# EAGLE design Protector (EAGLE 5.07)
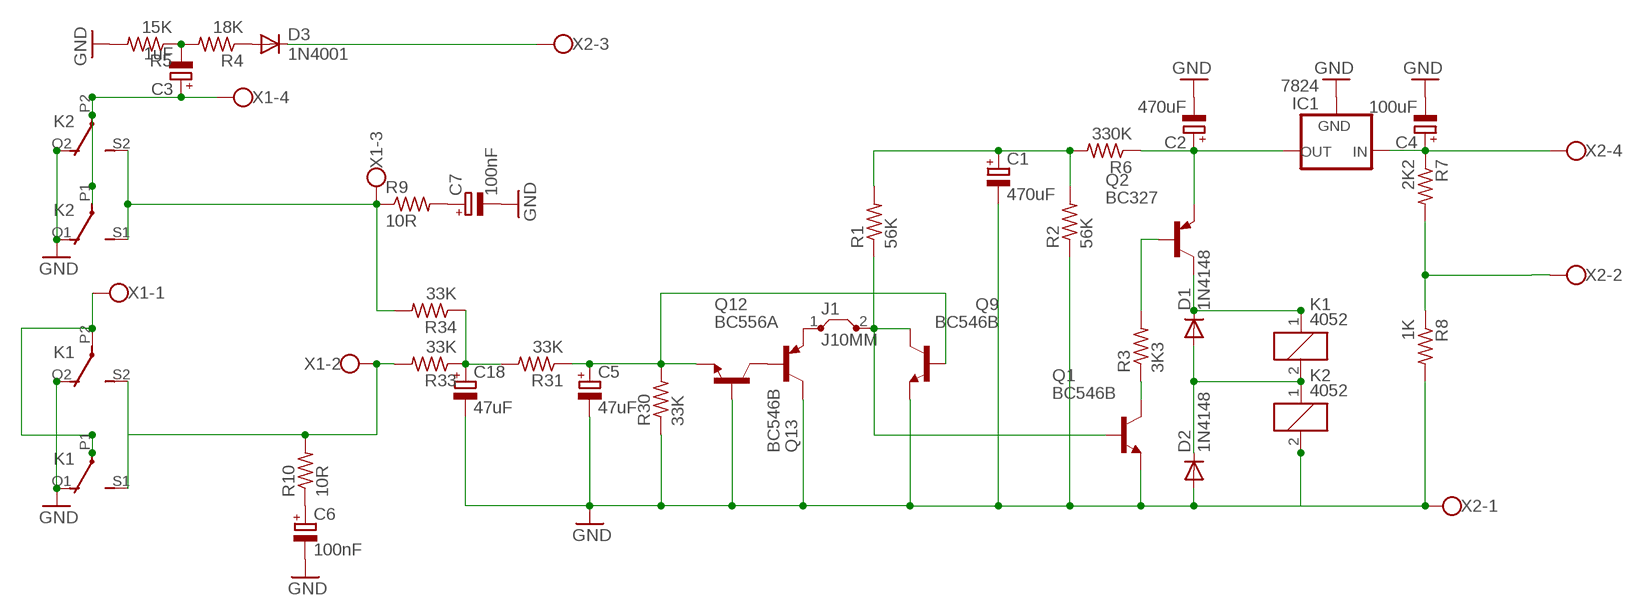
[diagram p0: schematic, sheet 1]

## Parts
C1  470uF  CPOL-EUE5-8.5  [E5-8,5]
C2  470uF  CPOL-EUE5-8.5  [E5-8,5]
C3  1uF  CPOL-EUE5-8.5  [E5-8,5]
C4  100uF  CPOL-EUE5-8.5  [E5-8,5]
C5  47uF  CPOL-EUE5-8.5  [E5-8,5]
C6  100nF  CPOL-EUE5-8.5  [E5-8,5]
C7  100nF  CPOL-EUE5-8.5  [E5-8,5]
C18  47uF  CPOL-EUE5-8.5  [E5-8,5]
D1  1N4148  1N4004  [DO41-10]
D2  1N4148  1N4004  [DO41-10]
D3  1N4001  1N4004  [DO41-10]
IC1  7824  78XXS  [78XXS]
J1  J10MM  [10]
K1  4052  [F4052]
K2  4052  [F4052]
Q1  BC546B  BC546A  [TO92-EBC]
Q2  BC327  BC556  [TO92-EBC]
Q9  BC546B  BC546A  [TO92-EBC]
Q12  BC556A  BC556  [TO92-EBC]
Q13  BC546B  BC546A  [TO92-EBC]
R1  56K  R-US_0309/12  [0309/12]
R2  56K  R-US_0309/12  [0309/12]
R3  3K3  R-US_0309/12  [0309/12]
R4  18K  R-US_0309/12  [0309/12]
R5  15K  R-US_0309/12  [0309/12]
R6  330K  R-US_0309/12  [0309/12]
R7  2K2  R-US_0617/17  [0617/17]
R8  1K  R-US_0617/17  [0617/17]
R9  10R  R-US_0309/10  [0309/10]
R10  10R  R-US_0309/10  [0309/10]
R30  33K  R-US_0309/12  [0309/12]
R31  33K  R-US_0309/12  [0309/12]
R33  33K  R-US_0309/12  [0309/12]
R34  33K  R-US_0617/17  [0617/17]
X1  W237-04P  [W237-4P]
X2  W237-04P  [W237-4P]

## Nets
GND: C1.- C2.- C4.- C5.- C6.- C7.- C18.- D2.A IC1.GND K1.O1(2:O) K1.O2(3:O) K2.2 K2.O1(2:O) K2.O2(3:O) Q1.E Q9.E Q12.C Q13.B R2.1 R5.2 R8.2 R30.1 X2.1
N$1: C1.+ R1.2 R2.2 R6.2
N$2: Q1.C R3.1
N$3: Q2.B R3.2
N$4: C2.+ IC1.OUT Q2.E R6.1
N$5: D1.C K1.1 Q2.C
N$6: J1.1 Q12.E
N$7: K1.S1(2:S) K1.S2(3:S) R10.2 R33.2 X1.2
N$8: D1.A D2.C K1.2 K2.1
N$9: C3.- R4.2 R5.1
N$10: K1.P1(2:P) K1.P2(3:P) X1.1
N$11: C3.+ K2.P1(2:P) K2.P2(3:P) X1.4
N$12: K2.S1(2:S) K2.S2(3:S) R9.1 R34.2 X1.3
N$13: J1.2 Q1.B Q9.C R1.1
N$14: D3.A R4.1
N$15: C4.+ IC1.IN R7.1 X2.4
N$16: R7.2 R8.1 X2.2
N$17: D3.C X2.3
N$18: C6.+ R10.1
N$19: C7.+ R9.2
N$49: Q12.B Q13.C
N$50: C5.+ Q9.B Q13.E R30.2 R31.1
N$51: C18.+ R31.2 R33.1 R34.1

## Library data of the parts
C1-C7 C18 = resistor:CPOL-EU: POLARIZED CAPACITOR, European symbol
D1-D3 = diode:1N4004: DIODE general purpose rectifier, 1 A
IC1 = v-reg:78XXS: VOLTAGE REGULATOR
J1 = jumper:J: Bridge
K1 K2 = relay:4052: RELAY 2 x switch, Finder
Q1 Q9 Q13 = transistor-npn:BC546*: NPN Transistor
Q2 Q12 = transistor-pnp:BC556*: PNP Transistror
R1-R10 R30 R31 R33 R34 = resistor:R-US_: RESISTOR, American symbol
X1 X2 = con-wago-508:W237-04P: WAGO SREW CLAMP

## Board
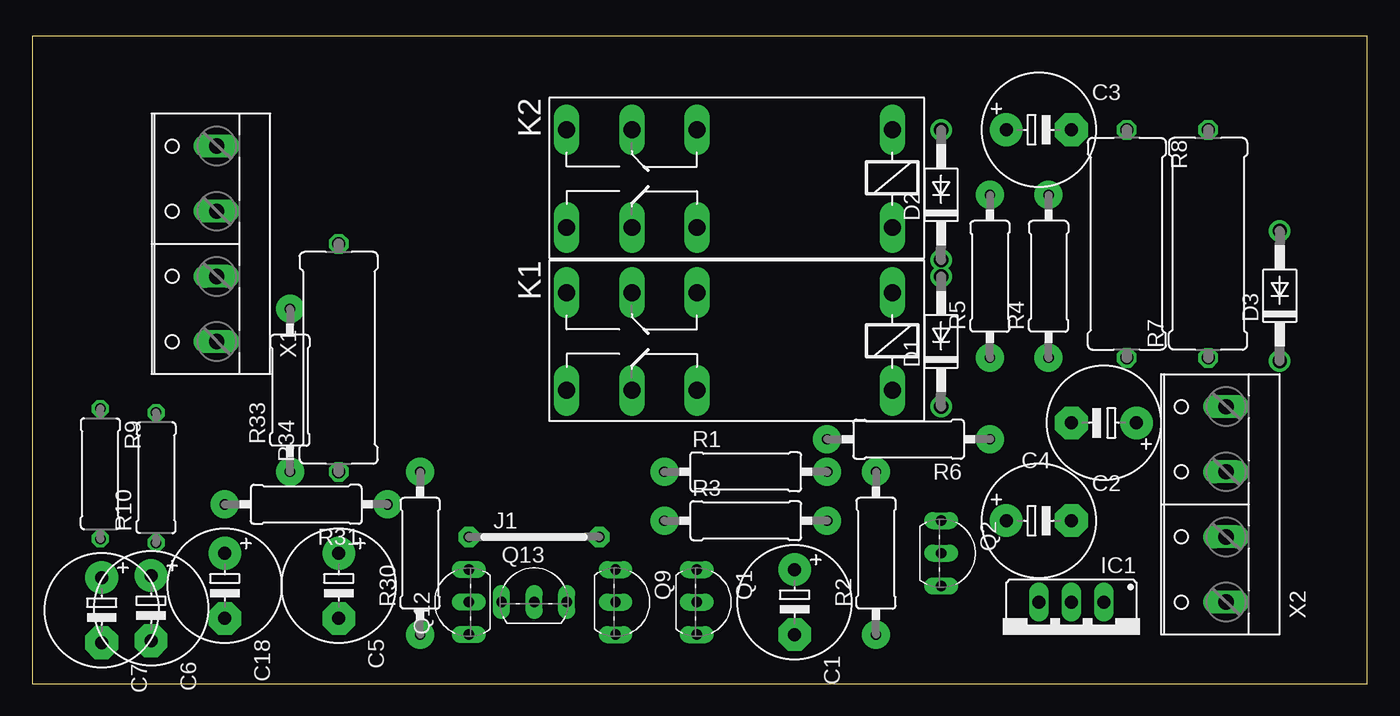
[diagram p1: board, top side]
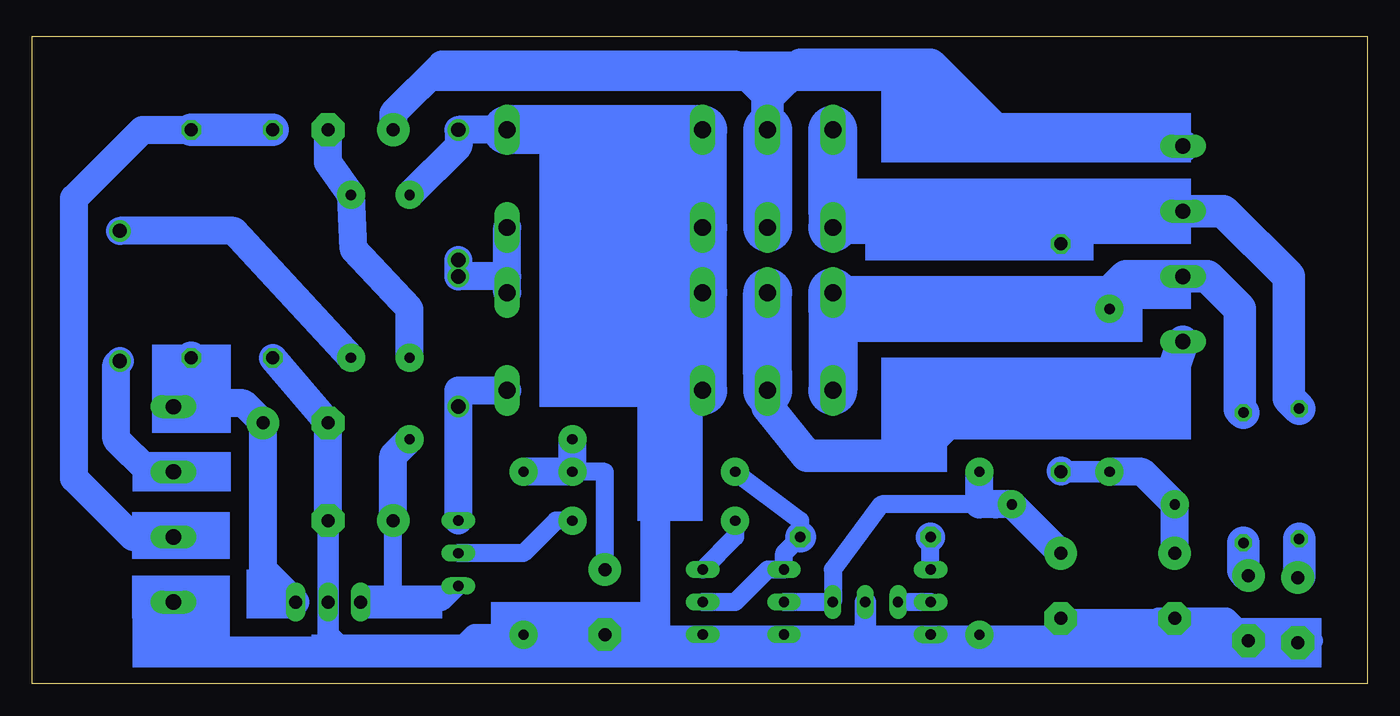
[diagram p2: board, bottom side, seen from below]

Size 104.17 x 50.47 mm. Coordinates in mm from the lower left corner, seen from the top.
Outline: 0,0 104.17,0 104.17,50.47 0,50.47 0,0
Copper layers (1*16): Top 0.035mm / dielectric 1.5mm / Bottom 0.035mm
Design rules "default": minimum track width 10mil, minimum drill 24mil, track to track 8mil, track to pad 8mil, pad to pad 8mil, via to via 8mil, smd to smd 8mil, copper to edge 40mil, drill to drill 8mil, minimum pad ring 10mil, minimum via ring 8mil, stop-mask expansion 4mil, vias tented up to drill 0mil, thermal gap 10mil

### Footprints (pad centres in the part's own frame; a part is rotated, then mirrored left to right if it is on the bottom)
E5-8,5 = drill 1.016 pad 2.54 round: + -2.54,0 | drill 1.016 pad 2.54 octagon: - 2.54,0
DO41-10 = drill 1.118 round: A 5.08,0; C -5.08,0
78XXS = drill 1.016 long: GND 0,-2.54; IN -2.54,-2.54; OUT 2.54,-2.54
10 = drill 0.813 pad 1.6 octagon: 1 -5.08,0; 2 5.08,0
F4052 = drill 1.321 long: 1 -3.81,3.81; 2 -3.81,-3.81; O1 11.43,-3.81; O2 11.43,3.81; P1 16.51,-3.81; P2 16.51,3.81; S1 21.59,-3.81; S2 21.59,3.81
TO92-EBC = drill 0.813 long: B 0,-1.27; C -2.54,-1.27; E 2.54,-1.27
0309/12 = drill 0.8 pad 2.184 round: 1 -6.35,0; 2 6.35,0
0617/17 = drill 1.016 octagon: 1 -8.89,0; 2 8.89,0
0309/10 = drill 0.813 octagon: 1 -5.08,0; 2 5.08,0
W237-4P = drill 1.194 long: 1 -7.62,-0.635; 2 -2.54,-0.635; 3 2.54,-0.635; 4 7.62,-0.635

### Placement (x,y rotation side)
C1  59.48,6.35 270 top
C2  78.53,12.7 0 top
C3  78.53,43.18 0 top
C4  83.61,20.32 180 top
C5  23.92,7.62 270 top
C6  9.28,5.88 270 top
C7  5.43,5.72 270 top
C18  15.03,7.62 270 top
D1  70.91,26.67 90 top
D2  70.91,38.1 90 top
D3  97.33,30.23 90 top
IC1  81.07,3.81 180 top
J1  39.16,11.43 0 top
K1  63.29,26.67 180 top
K2  63.29,39.37 180 top
Q1  53.13,6.35 270 top
Q2  72.18,10.16 270 top
Q9  46.78,6.35 270 top
Q12  32.81,6.35 90 top
Q13  39.16,7.62 0 top
R1  55.67,16.51 0 top
R2  65.83,10.16 90 top
R3  55.67,12.7 0 top
R4  79.3,31.75 90 top
R5  74.72,31.75 90 top
R6  68.37,19.05 180 top
R7  91.74,34.29 90 top
R8  85.39,34.29 270 top
R9  5.32,16.36 270 top
R10  9.68,16.05 90 top
R30  30.27,10.16 90 top
R31  21.38,13.97 180 top
R33  20.11,22.86 90 top
R34  23.92,25.4 90 top
X1  13.76,34.29 90 top
X2  92.5,13.97 90 top

### Tracks (layer width: path | path; a pad name or v marks a point on that pad's centre or on a via)
GND
  Bottom 1.422: C18.- 16.3,5.08 C5.- 23.92,3.81 R30.1 Q12.C 39.19,3.81 Q9.E Q1.E 55.67,3.81 | 55.67,3.81 C1.- R2.1 | K1.O2 55.67,19.05 55.67,3.81
  Bottom 1.676: R2.1 69.64,3.81 70.91,2.54 79.8,2.54 81.07,3.81 IC1.GND C2.- | Q13.B 39.17,4.47 39.19,4.45 39.19,3.81 | C7.- 4.32,3.34 C6.- 11.02,5.08 16.3,5.08
  Bottom 2.184: K2.2 D2.A 70.91,41.91 R5.2 | R8.2 C4.- C2.- | X2.1 92.5,5.71 92.5,5.08 89.96,2.54 79.8,2.54
  Bottom 3.81: K1.O2 K1.O1 K2.O2 K2.O1 K2.2
N$1
  Bottom 1.422: C1.+ 59.48,16.51 R1.2
  Bottom 2.184: R2.2 R1.2 R6.2
N$2
  Bottom 1.422: Q1.C 49.32,11.43 R3.1
N$3
  Bottom 1.422: Q2.B 65.83,10.16 63.29,12.7 R3.2
N$4
  Bottom 1.422: Q2.E 72.18,6.35 75.99,6.35 | 75.99,6.35 IC1.OUT | 75.99,6.35 C2.+
  Bottom 2.184: R6.1 75.99,17.78 C2.+
N$5
  Bottom 2.184: K1.1 70.91,22.86 D1.C Q2.C
N$6
  Bottom 1.422: Q12.E J1.1
N$7
  Bottom 1.422: K1.S2 41.7,21.59
  Bottom 2.54: 41.7,29.21 R33.2 21.38,29.21 18.84,31.75 X1.2 12.49,31.75 9.95,29.21 9.95,21.41 R10.2
  Bottom 3.81: K1.S2 41.7,29.21 K1.S1
N$8
  Bottom 2.184: K1.2 67.1,31.75 | 67.1,31.75 K2.1 | D2.C D1.A 67.1,31.75
N$9
  Bottom 2.184: C3.- 81.07,40.64 R4.2 79.08,33.86 74.72,29.21 R5.1
N$10
  Bottom 2.54: X1.1 15.67,22.86 30.27,22.86 35.35,17.78 43.74,17.78 46.78,21.59 46.78,24.13
  Bottom 3.81: K1.P2 46.78,24.13 K1.P1
N$11
  Bottom 2.184: C3.+ 75.99,44.45 72.18,48.26 49.32,48.26 46.78,45.72
  Bottom 2.54: X1.4 27.73,41.91 34.08,48.26 44.24,48.26 46.78,45.72 K2.P1
  Bottom 3.81: K2.P1 K2.P2
N$12
  Bottom 1.422: R34.2 23.92,35.56 K2.S2
  Bottom 2.54: 41.7,36.83 16.3,36.83 X1.3 11.22,36.83 6.14,31.75 6.14,22.26 R9.1
  Bottom 3.81: K2.S2 41.7,36.83 K2.S1
N$13
  Bottom 1.422: Q1.B 49.32,6.35 46.78,8.89 Q9.C 45.51,10.16 J1.2 44.24,12.7 R1.1
N$14
  Bottom 2.184: R4.1 88.44,35.31 D3.A
N$15
  Bottom 2.184: IC1.IN 86.15,8.89 C4.+ 87.68,21.84 89.71,21.84 | X2.4 89.96,21.59 89.71,21.84 | 89.71,21.84 90.98,21.84 91.22,21.6 | 91.22,21.6 91.91,21.6 | 91.22,21.6 90.9,21.6 91.05,21.76 91.05,22.15 91.02,22.12 91.02,21.42
  Bottom 2.54: 89.96,21.59 91.74,24.13 R7.1
N$16
  Bottom 2.184: X2.2 96.31,11.43 100.89,16 100.89,37.85 95.55,43.18 R7.2
  Bottom 2.54: R7.2 R8.1
N$17
  Bottom 2.184: D3.C 97.58,24.89 97.58,19.05 95.04,16.51 X2.3 92.5,16.51
N$18
  Bottom 2.54: C6.+ 9.68,8.82 R10.1
N$19
  Bottom 2.54: C7.+ 5.32,8.37 R9.2
N$49
  Bottom 1.422: Q12.B Q13.C
N$50
  Bottom 1.422: Q9.B Q13.E 41.7,8.89 37.89,13.97 30.27,13.97
  Bottom 2.184: C5.+ R31.1 29,13.97 30.27,13.97 R30.2
N$51
  Bottom 1.676: R33.1 R34.1
  Bottom 2.184: R33.1 17.57,16.51 R31.2 C18.+
(copper drawn outside any net)
  shapes: Bottom area x43, Bottom circle x3